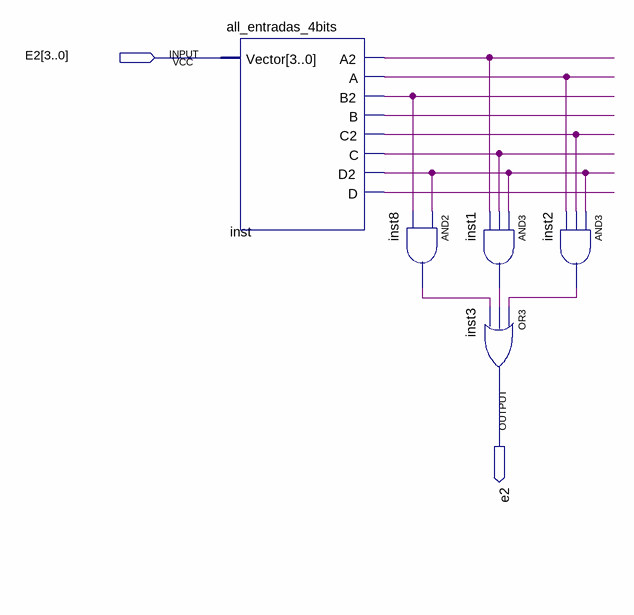
[diagram p0: schematic sheet]
// Quartus schematic e2_4bits.bdf as structural Verilog: 5 symbols, 2 pins
module e2_4bits (
  input  [3:0] E2,
  output E2_1bit
);

  wire inst1_out, inst2_out, inst8_out, inst_a, inst_a2, inst_b, inst_b2, inst_c, inst_c2, inst_d, inst_d2;

  all_entradas_4bits inst (
    .Vector(E2), .A2(inst_a2), .A(inst_a), .B2(inst_b2), .B(inst_b), .C2(inst_c2), .C(inst_c), .D2(inst_d2),
    .D(inst_d));
  and inst8 (inst8_out, inst_d2, inst_b2);
  and inst1 (inst1_out, inst_d2, inst_c, inst_a2);
  or inst3 (E2_1bit, inst2_out, inst1_out, inst8_out);
  and inst2 (inst2_out, inst_d2, inst_c2, inst_a);
endmodule
